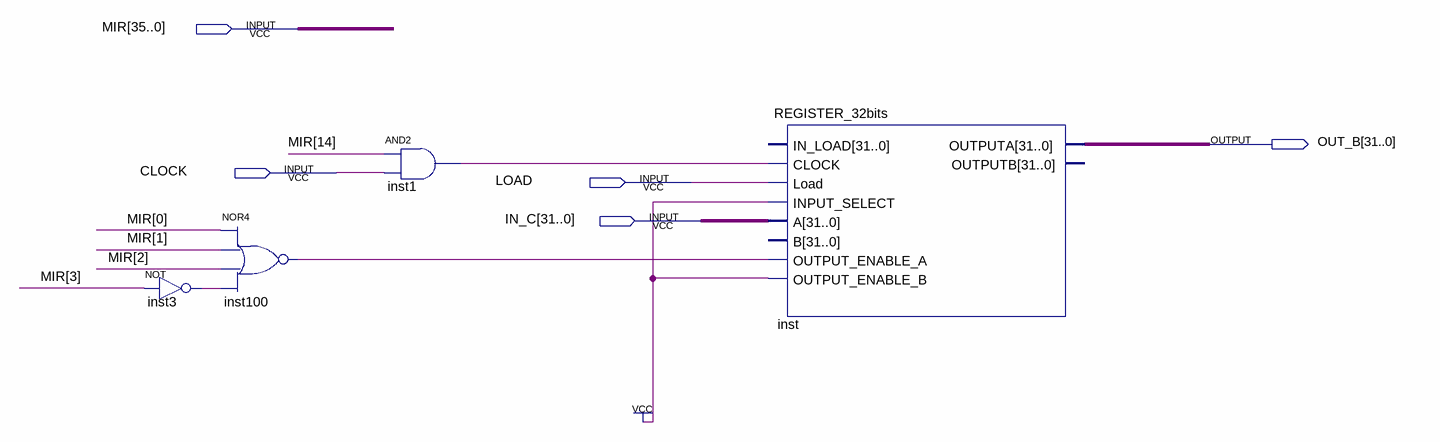
[diagram p0: schematic sheet]
// Quartus schematic OPC.bdf as structural Verilog: 4 symbols, 5 pins
module OPC (
  input  [35:0] MIR,
  input  CLOCK,
  input  LOAD,
  input  [31:0] IN_C,
  output [31:0] OUT_B
);

  wire inst1_out, inst3_out, inst100_out;

  not inst3 (inst3_out, MIR[3]);
  nor inst100 (inst100_out, MIR[0], MIR[1], MIR[2], inst3_out);
  and inst1 (inst1_out, MIR[14], CLOCK);
  REGISTER_32bits inst (
    .CLOCK(inst1_out), .Load(LOAD), .INPUT_SELECT(1'b1), .A(IN_C), .OUTPUT_ENABLE_A(inst100_out),
    .OUTPUT_ENABLE_B(1'b1), .OUTPUTA(OUT_B));  // open: IN_LOAD, B, OUTPUTB
endmodule
